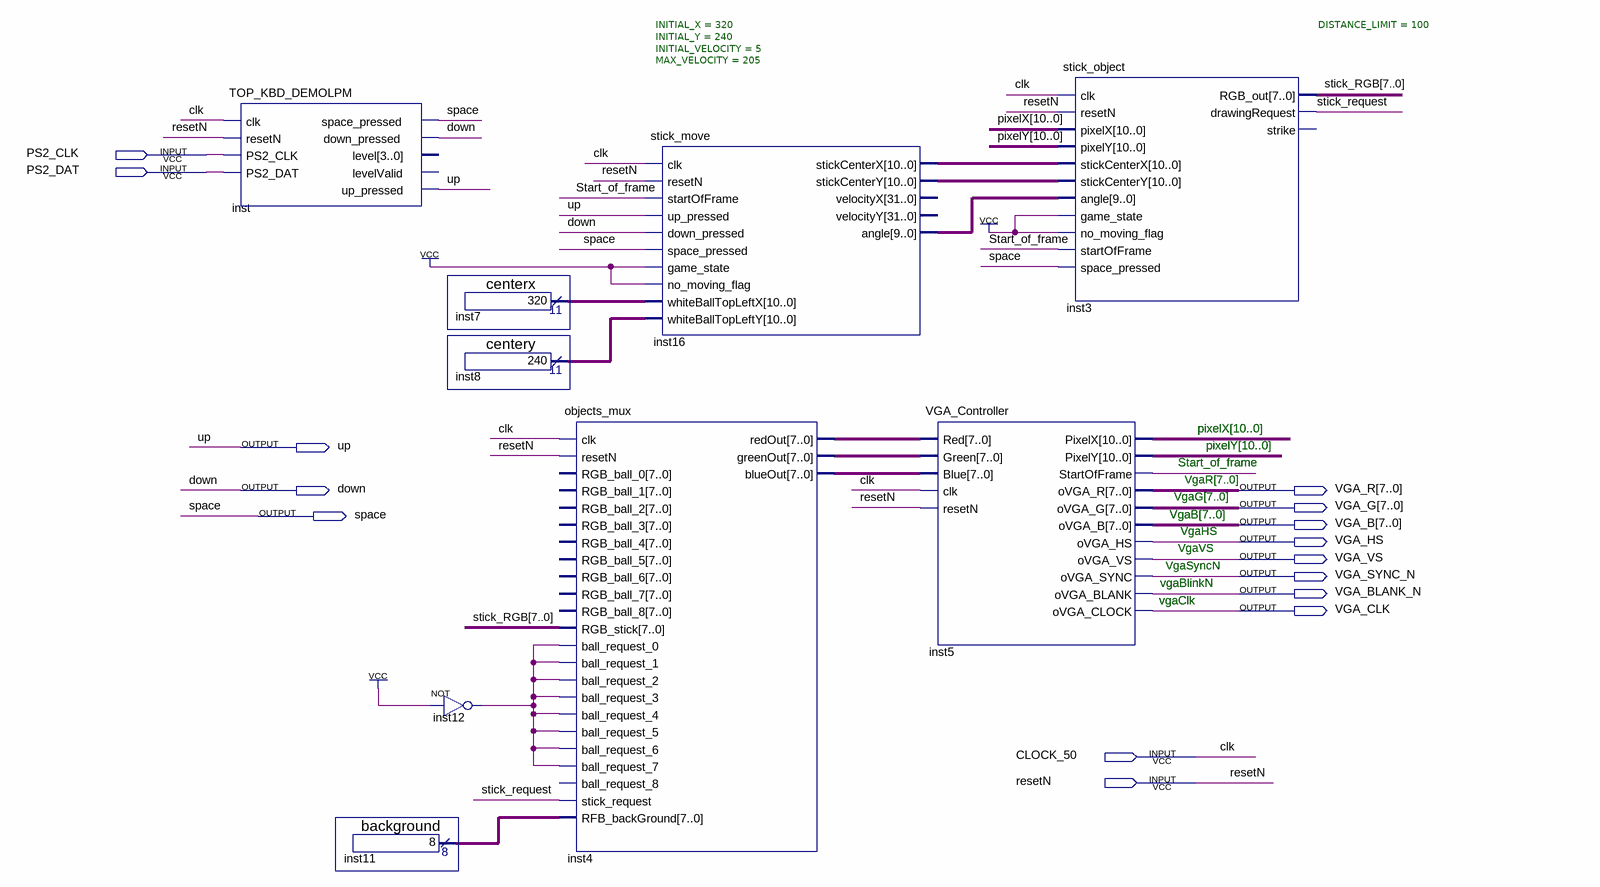
[diagram p0: schematic sheet]
// Quartus schematic TOP_STICK_TEST.bdf as structural Verilog: 9 symbols, 15 pins
module TOP_STICK_TEST (
  input  PS2_CLK,
  input  PS2_DAT,
  input  CLOCK_50,
  input  resetN,
  output up,
  output down,
  output [7:0] VGA_R,
  output [7:0] VGA_G,
  output space,
  output [7:0] VGA_B,
  output VGA_HS,
  output VGA_VS,
  output VGA_SYNC_N,
  output VGA_BLANK_N,
  output VGA_CLK
);

  wire inst12_out, Start_of_frame, stick_request;
  wire [7:0] inst4_blueout, inst4_greenout, inst4_redout, inst11_result, stick_RGB;
  wire [9:0] inst16_angle;
  wire [10:0] inst7_result, inst8_result, inst16_stickcenterx, inst16_stickcentery, pixelX, pixelY;

  TOP_KBD_DEMOLPM inst (
    .clk(CLOCK_50), .resetN(resetN), .PS2_CLK(PS2_CLK), .PS2_DAT(PS2_DAT), .space_pressed(space),
    .down_pressed(down), .up_pressed(up));  // open: level, levelValid
  background inst11 (.result(inst11_result));
  centerx inst7 (.result(inst7_result));
  centery inst8 (.result(inst8_result));
  not inst12 (inst12_out, 1'b1);
  objects_mux inst4 (
    .clk(CLOCK_50), .resetN(resetN), .RGB_stick(stick_RGB), .ball_request_0(inst12_out),
    .ball_request_1(inst12_out), .ball_request_2(inst12_out), .ball_request_3(inst12_out),
    .ball_request_4(inst12_out), .ball_request_5(inst12_out), .ball_request_6(inst12_out),
    .ball_request_7(inst12_out), .stick_request(stick_request), .RFB_backGround(inst11_result),
    .redOut(inst4_redout), .greenOut(inst4_greenout), .blueOut(inst4_blueout));  // open: RGB_ball_0, RGB_ball_1, RGB_ball_2, RGB_ball_3, RGB_ball_4, RGB_ball_5, RGB_ball_6, RGB_ball_7, RGB_ball_8, ball_request_8
  stick_move #(.INITIAL_X(320), .INITIAL_Y(240), .INITIAL_VELOCITY(5), .MAX_VELOCITY(205)) inst16 (
    .clk(CLOCK_50), .resetN(resetN), .startOfFrame(Start_of_frame), .up_pressed(up), .down_pressed(down),
    .space_pressed(space), .game_state(1'b1), .no_moving_flag(1'b1), .whiteBallTopLeftX(inst7_result),
    .whiteBallTopLeftY(inst8_result), .stickCenterX(inst16_stickcenterx), .stickCenterY(inst16_stickcentery),
    .angle(inst16_angle));  // open: velocityX, velocityY
  VGA_Controller inst5 (
    .Red(inst4_redout), .Green(inst4_greenout), .Blue(inst4_blueout), .clk(CLOCK_50), .resetN(resetN),
    .PixelX(pixelX), .PixelY(pixelY), .StartOfFrame(Start_of_frame), .oVGA_R(VGA_R), .oVGA_G(VGA_G),
    .oVGA_B(VGA_B), .oVGA_HS(VGA_HS), .oVGA_VS(VGA_VS), .oVGA_SYNC(VGA_SYNC_N), .oVGA_BLANK(VGA_BLANK_N),
    .oVGA_CLOCK(VGA_CLK));
  stick_object #(.DISTANCE_LIMIT(100)) inst3 (
    .clk(CLOCK_50), .resetN(resetN), .pixelX(pixelX), .pixelY(pixelY), .stickCenterX(inst16_stickcenterx),
    .stickCenterY(inst16_stickcentery), .angle(inst16_angle), .game_state(1'b1), .no_moving_flag(1'b1),
    .startOfFrame(Start_of_frame), .space_pressed(space), .RGB_out(stick_RGB), .drawingRequest(stick_request));  // open: strike

  // Other names for the same wires on the sheet: clk = CLOCK_50; VgaB[7:0] = VGA_B; vgaBlinkN = VGA_BLANK_N;
  //   vgaClk = VGA_CLK; VgaG[7:0] = VGA_G; VgaHS = VGA_HS; VgaR[7:0] = VGA_R; VgaSyncN = VGA_SYNC_N; VgaVS = VGA_VS

  // Notes on the sheet:
  //   pixelX[10..0]
  //   pixelY[10..0]
  //   Start_of_frame
  //   VgaR[7..0]
  //   VgaG[7..0]
  //   VgaB[7..0]
  //   VgaHS
  //   VgaVS
  //   VgaSyncN
  //   vgaBlinkN
  //   vgaClk
endmodule
